# Altium schematic sheet MCU.SchDoc: Наименование
size 209 x 297 mm; ApprovedBy: Утвердил; CheckedBy: Проверил; Author: Разработал; CompanyName: Организация; DrawnBy: Н.Контр; Engineer: Т.Контр; SheetNumber: 1; SheetTotal: 1; PageSetup: Record=PageOptions|CenterHorizontal=True|CenterVertical=True|PrintScale=0.94|XCorrection=1.00|YCorrection=1.00|PrintKind=1|BorderSize=5000000|LeftOffset=0|BottomOffset=0|Orientation=1|PaperLength=1000|PaperWidth=1000|Scale=100|PaperSource=7|PrintQuality=-4|MediaType=1|DitherType=10|PaperKind=A4|PrintScaleMode=1; DecimalNumber: Децимальный номер; HeadOfSector: Нач. сектора; MainDevice: Перв.примен.; Name: Наименование; DocumentName: Sheet1.SCHDOC
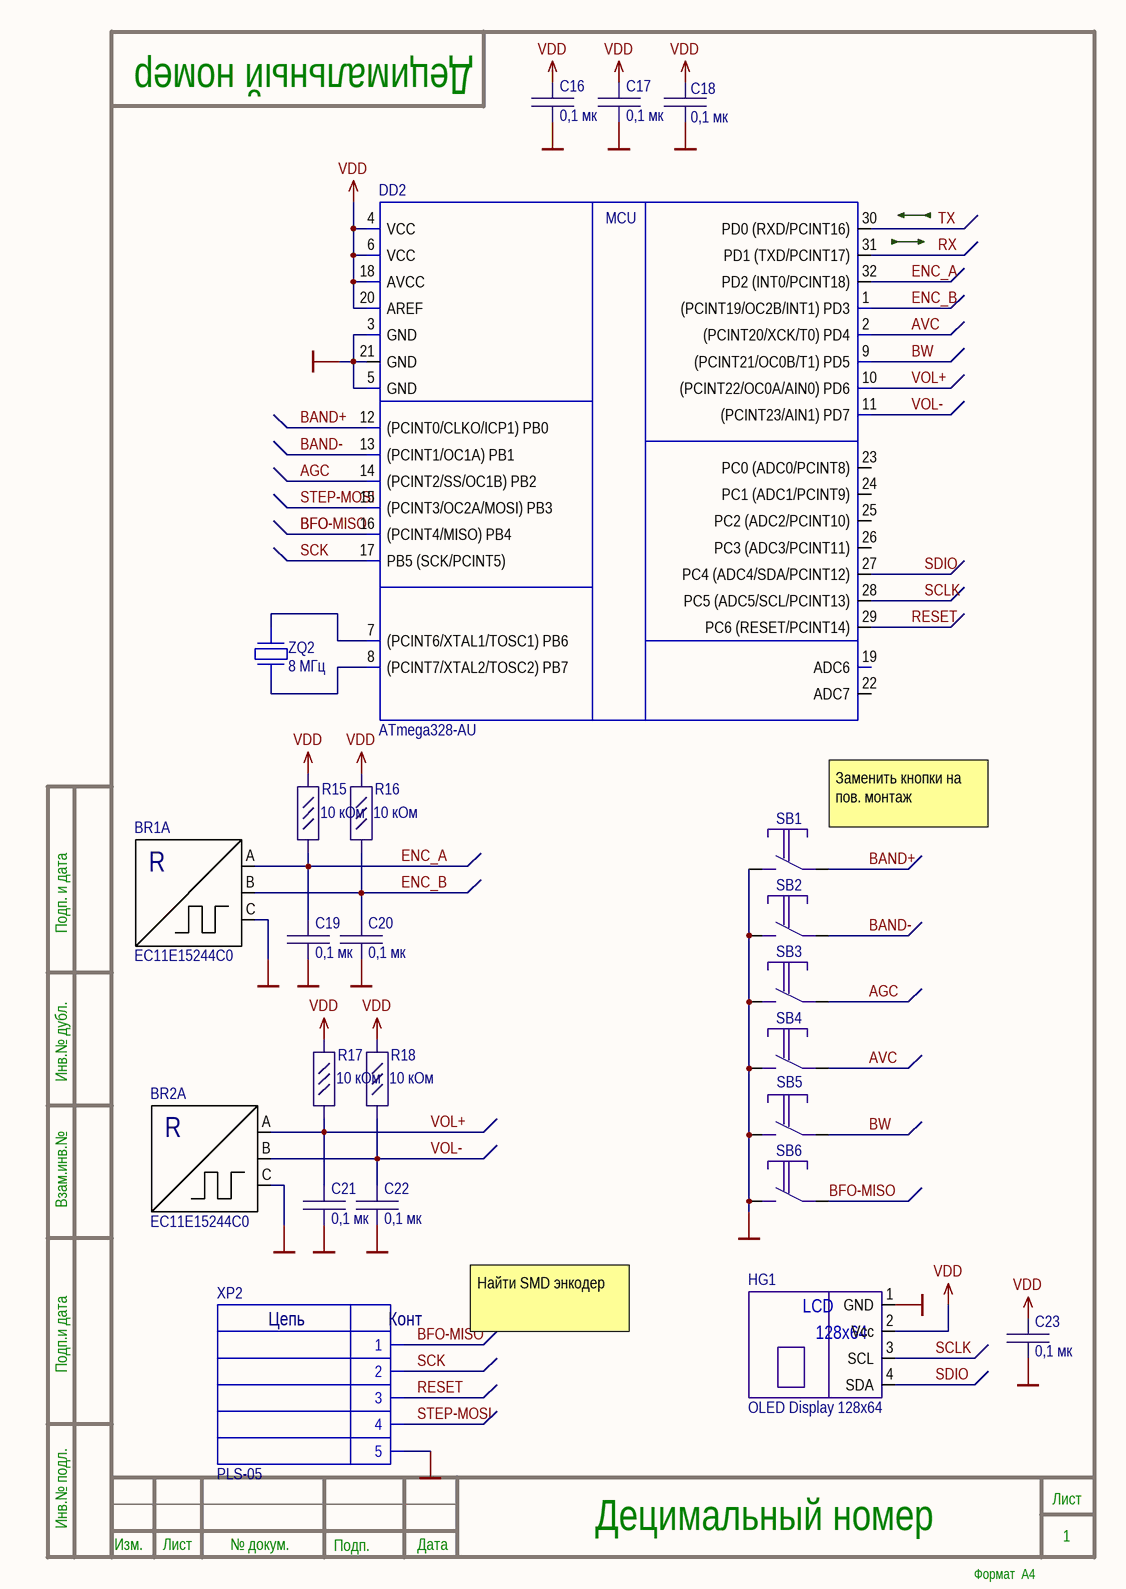
[diagram p0: MCU.SchDoc]

## Parts
BR1  EC11E15244C0  [EC11]  (part A of 2)
BR2  EC11E15244C0  [EC11]  (part A of 2)
C16  0,1 мк  [C_0603]
C17  0,1 мк  [C_0603]
C18  0,1 мк  [C_0603]
C19  0,1 мк  [C_0603]
C20  0,1 мк  [C_0603]
C21  0,1 мк  [C_0603]
C22  0,1 мк  [C_0603]
C23  0,1 мк  [C_0603]
DD2  ATmega328-AU  [TQFP32]
HG1  OLED Display 128x64  [OLED Display 128x64]
R15  10 кОм  [R_0603]
R16  10 кОм  [R_0603]
R17  10 кОм  [R_0603]
R18  10 кОм  [R_0603]
SB1  KLS7-TS6601  [KLS7-TS6601]  (value not drawn)
SB2  KLS7-TS6601  [KLS7-TS6601]  (value not drawn)
SB3  KLS7-TS6601  [KLS7-TS6601]  (value not drawn)
SB4  KLS7-TS6601  [KLS7-TS6601]  (value not drawn)
SB5  KLS7-TS6601  [KLS7-TS6601]  (value not drawn)
SB6  KLS7-TS6601  [KLS7-TS6601]  (value not drawn)
XP2  PLS-05  [PLS-5]
ZQ2  8 МГц  [MJ CRYSTAL]

## Nets
GND: BR1.C BR2.C C16.2 C17.2 C18.2 C19.2 C20.2 C21.2 C22.2 C23.2 DD2.3(GND) DD2.5(GND) DD2.21(GND) HG1.1(GND) SB1.1 SB2.1 SB3.1 SB4.1 SB5.1 SB6.1 XP2.5
VDD: C16.1 C17.1 C18.1 C23.1 DD2.4(VCC) DD2.6(VCC) DD2.18(AVCC) DD2.20(AREF) HG1.2(Vcc) R15.2 R16.2 R17.2 R18.2
AGC: DD2.14((PCINT2/SS/OC1B)_PB2) SB3.2
AVC: DD2.2((PCINT20/XCK/T0)_PD4) SB4.2
BAND+: DD2.12((PCINT0/CLKO/ICP1)_PB0) SB1.2
BAND-: DD2.13((PCINT1/OC1A)_PB1) SB2.2
BFO: DD2.16((PCINT4/MISO)_PB4) SB6.2 XP2.1  [also labelled BFO-MISO]
BW: DD2.9((PCINT21/OC0B/T1)_PD5) SB5.2
ENC_A: BR1.A C19.1 DD2.32(PD2_(INT0/PCINT18)) R15.1
ENC_B: BR1.B C20.1 DD2.1((PCINT19/OC2B/INT1)_PD3) R16.1
RESET: DD2.29(PC6_(RESET/PCINT14)) XP2.3
RX: DD2.31(PD1_(TXD/PCINT17))
SCK: DD2.17(PB5_(SCK/PCINT5)) XP2.2
SCLK: DD2.28(PC5_(ADC5/SCL/PCINT13)) HG1.3(SCL)
SDIO: DD2.27(PC4_(ADC4/SDA/PCINT12)) HG1.4(SDA)
STEP-MOSI: DD2.15((PCINT3/OC2A/MOSI)_PB3) XP2.4
TX: DD2.30(PD0_(RXD/PCINT16))
VOL+: BR2.A C21.1 DD2.10((PCINT22/OC0A/AIN0)_PD6) R17.1
VOL-: BR2.B C22.1 DD2.11((PCINT23/AIN1)_PD7) R18.1
NetDD2_7: DD2.7((PCINT6/XTAL1/TOSC1)_PB6) ZQ2.3
NetDD2_8: DD2.8((PCINT7/XTAL2/TOSC2)_PB7) ZQ2.1

Not connected (* = marked no-connect by the designer): DD2 19(ADC6) 22(ADC7) 23(PC0_(ADC0/PCINT8)) 24(PC1_(ADC1/PCINT9)) 25(PC2_(ADC2/PCINT10)) 26(PC3_(ADC3/PCINT11))

## Notes on the sheet
- Заменить кнопки на пов. монтаж
- Найти SMD энкодер
- Подп. и дата
- Инв.№ дубл.
- Взам.инв.№
- Подп.и дата
- Инв.№ подл.
- Изм.
- Лист
- № докум.
- Подп.
- Дата
- Формат  A4
- (in symbol ATmega328-AU) MCU
- (in symbol EC11E15244C0, part A) R
- (in symbol OLED Display 128x64) LCD; 128x64
- (in symbol PLS-5) Цепь; Конт

## Library data of the parts
C16-C23 = GRM188R72A104MA35D: CAP CER 0.1UF 100V X7R 0603; Manufacturer: Murata Electronics; Value: 0.1µF; Part Number: GRM188R72A104MA35D; ComponentLink1URL: https://search.murata.co.jp/Ceramy/image/img/A01X/G101/ENG/GRM188R72A104MA35-01.pdf; ComponentLink1Description: Datasheet; Component Type: Capasitor
R15-R18 = CR0603-FX-1002ELF: RES SMD 10K OHM 1% 1/10W 0603; Manufacturer: Bourns Inc.; Part Number: CR0603-FX-1002ELF; Value: 10 кОм; ComponentLink1URL: https://www.bourns.com/pdfs/chpreztr.pdf; ComponentLink1Description: Datasheet; Component Type: Resistor
XP2 = PLS-5
ZQ2 = NX5032GA-8MHz